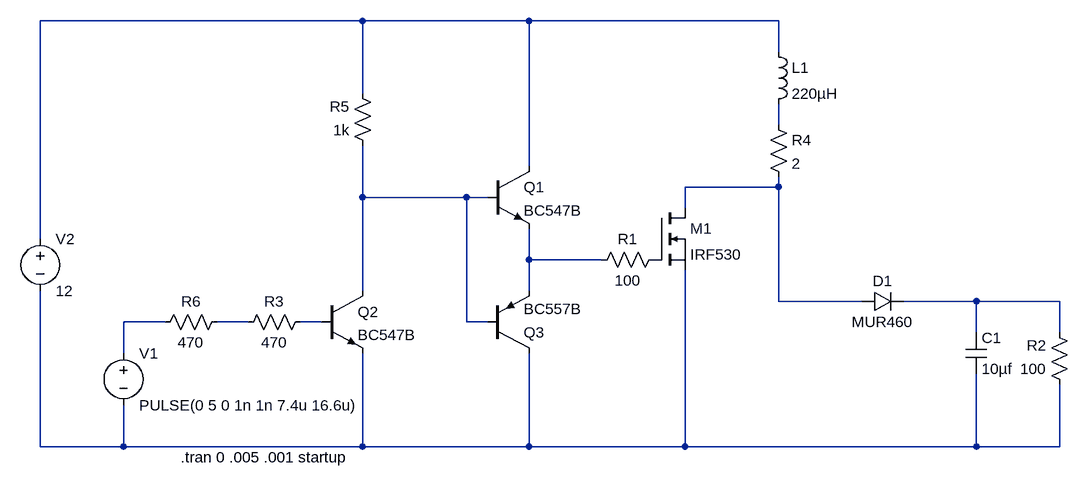
[diagram p0: schematic ejercicio3.asc]
ejercicio3.asc, the LTspice schematic file:
Version 4
SHEET 1 880 680
WIRE -272 -336 -768 -336
WIRE -16 -336 -272 -336
WIRE 368 -336 -16 -336
WIRE 368 -288 368 -336
WIRE -272 -224 -272 -336
WIRE 368 -176 368 -208
WIRE -16 -112 -16 -336
WIRE 368 -80 368 -96
WIRE 368 -80 224 -80
WIRE -272 -64 -272 -144
WIRE -112 -64 -272 -64
WIRE -80 -64 -112 -64
WIRE 224 -48 224 -80
WIRE -768 0 -768 -336
WIRE -16 32 -16 -16
WIRE 96 32 -16 32
WIRE -272 80 -272 -64
WIRE -16 80 -16 32
WIRE 368 96 368 -80
WIRE 496 96 368 96
WIRE 672 96 560 96
WIRE 800 96 672 96
WIRE -576 128 -640 128
WIRE -448 128 -496 128
WIRE -336 128 -368 128
WIRE -112 128 -112 -64
WIRE -80 128 -112 128
WIRE 672 144 672 96
WIRE 800 144 800 96
WIRE -640 176 -640 128
WIRE -768 320 -768 80
WIRE -640 320 -640 256
WIRE -640 320 -768 320
WIRE -272 320 -272 176
WIRE -272 320 -640 320
WIRE -16 320 -16 176
WIRE -16 320 -272 320
WIRE 224 320 224 48
WIRE 224 320 -16 320
WIRE 672 320 672 208
WIRE 672 320 224 320
WIRE 800 320 800 224
WIRE 800 320 672 320
SYMBOL pnp -80 176 M180
SYMATTR InstName Q3
SYMATTR Value BC557B
SYMBOL npn -336 80 R0
SYMATTR InstName Q2
SYMATTR Value BC547B
SYMBOL npn -80 -112 R0
SYMATTR InstName Q1
SYMATTR Value BC547B
SYMBOL res 816 240 R180
WINDOW 0 36 76 Left 2
WINDOW 3 36 40 Left 2
SYMATTR InstName R2
SYMATTR Value 100
SYMBOL res -464 144 R270
WINDOW 0 32 56 VTop 2
WINDOW 3 0 56 VBottom 2
SYMATTR InstName R3
SYMATTR Value 470
SYMBOL res 352 -192 R0
SYMATTR InstName R4
SYMATTR Value 2
SYMBOL res -256 -128 R180
WINDOW 0 36 76 Left 2
WINDOW 3 36 40 Left 2
SYMATTR InstName R5
SYMATTR Value 1k
SYMBOL res -592 144 R270
WINDOW 0 32 56 VTop 2
WINDOW 3 0 56 VBottom 2
SYMATTR InstName R6
SYMATTR Value 470
SYMBOL ind 352 -304 R0
SYMATTR InstName L1
SYMATTR Value 220µH
SYMBOL voltage -640 160 R0
WINDOW 123 0 0 Left 0
WINDOW 39 0 0 Left 0
SYMATTR InstName V1
SYMATTR Value PULSE(0 5 0 1n 1n 7.4u 16.6u)
SYMBOL voltage -768 -16 R0
WINDOW 123 0 0 Left 0
WINDOW 39 0 0 Left 0
SYMATTR InstName V2
SYMATTR Value 12
SYMBOL diode 496 112 R270
WINDOW 0 32 32 VTop 2
WINDOW 3 0 32 VBottom 2
SYMATTR InstName D1
SYMATTR Value MUR460
SYMBOL cap 656 144 R0
SYMATTR InstName C1
SYMATTR Value 10µf
SYMBOL res 192 16 R90
WINDOW 0 0 56 VBottom 2
WINDOW 3 32 56 VTop 2
SYMATTR InstName R1
SYMATTR Value 100
SYMBOL nmos 176 -48 R0
SYMATTR InstName M1
SYMATTR Value IRF530
TEXT -552 336 Left 2 !.tran 0 .005 .001 startup

The netlist it stands for:
* ejercicio3.asc
Q3 N010 N004 N005 0 BC557B
Q2 N004 N009 N010 0 BC547B
Q1 N001 N004 N005 0 BC547B
R2 N010 N006 100
R3 N008 N009 470
R4 N002 N003 2
R5 N004 N001 1k
R6 N007 N008 470
L1 N001 N002 220µH
V1 N007 N010 PULSE(0 5 0 1n 1n 7.4u 16.6u)
V2 N001 N010 12
D1 N003 N006 MUR460
C1 N006 N010 10µf
R1 P001 N005 100
M1 N003 P001 N010 N010 IRF530
.model D D
.lib standard.dio
.model NPN NPN
.model PNP PNP
.lib standard.bjt
.model NMOS NMOS
.model PMOS PMOS
.lib standard.mos
.tran 0 .005 .001 startup
.backanno
.end